# EAGLE design usbboarduino20 (EAGLE 9.6.2)
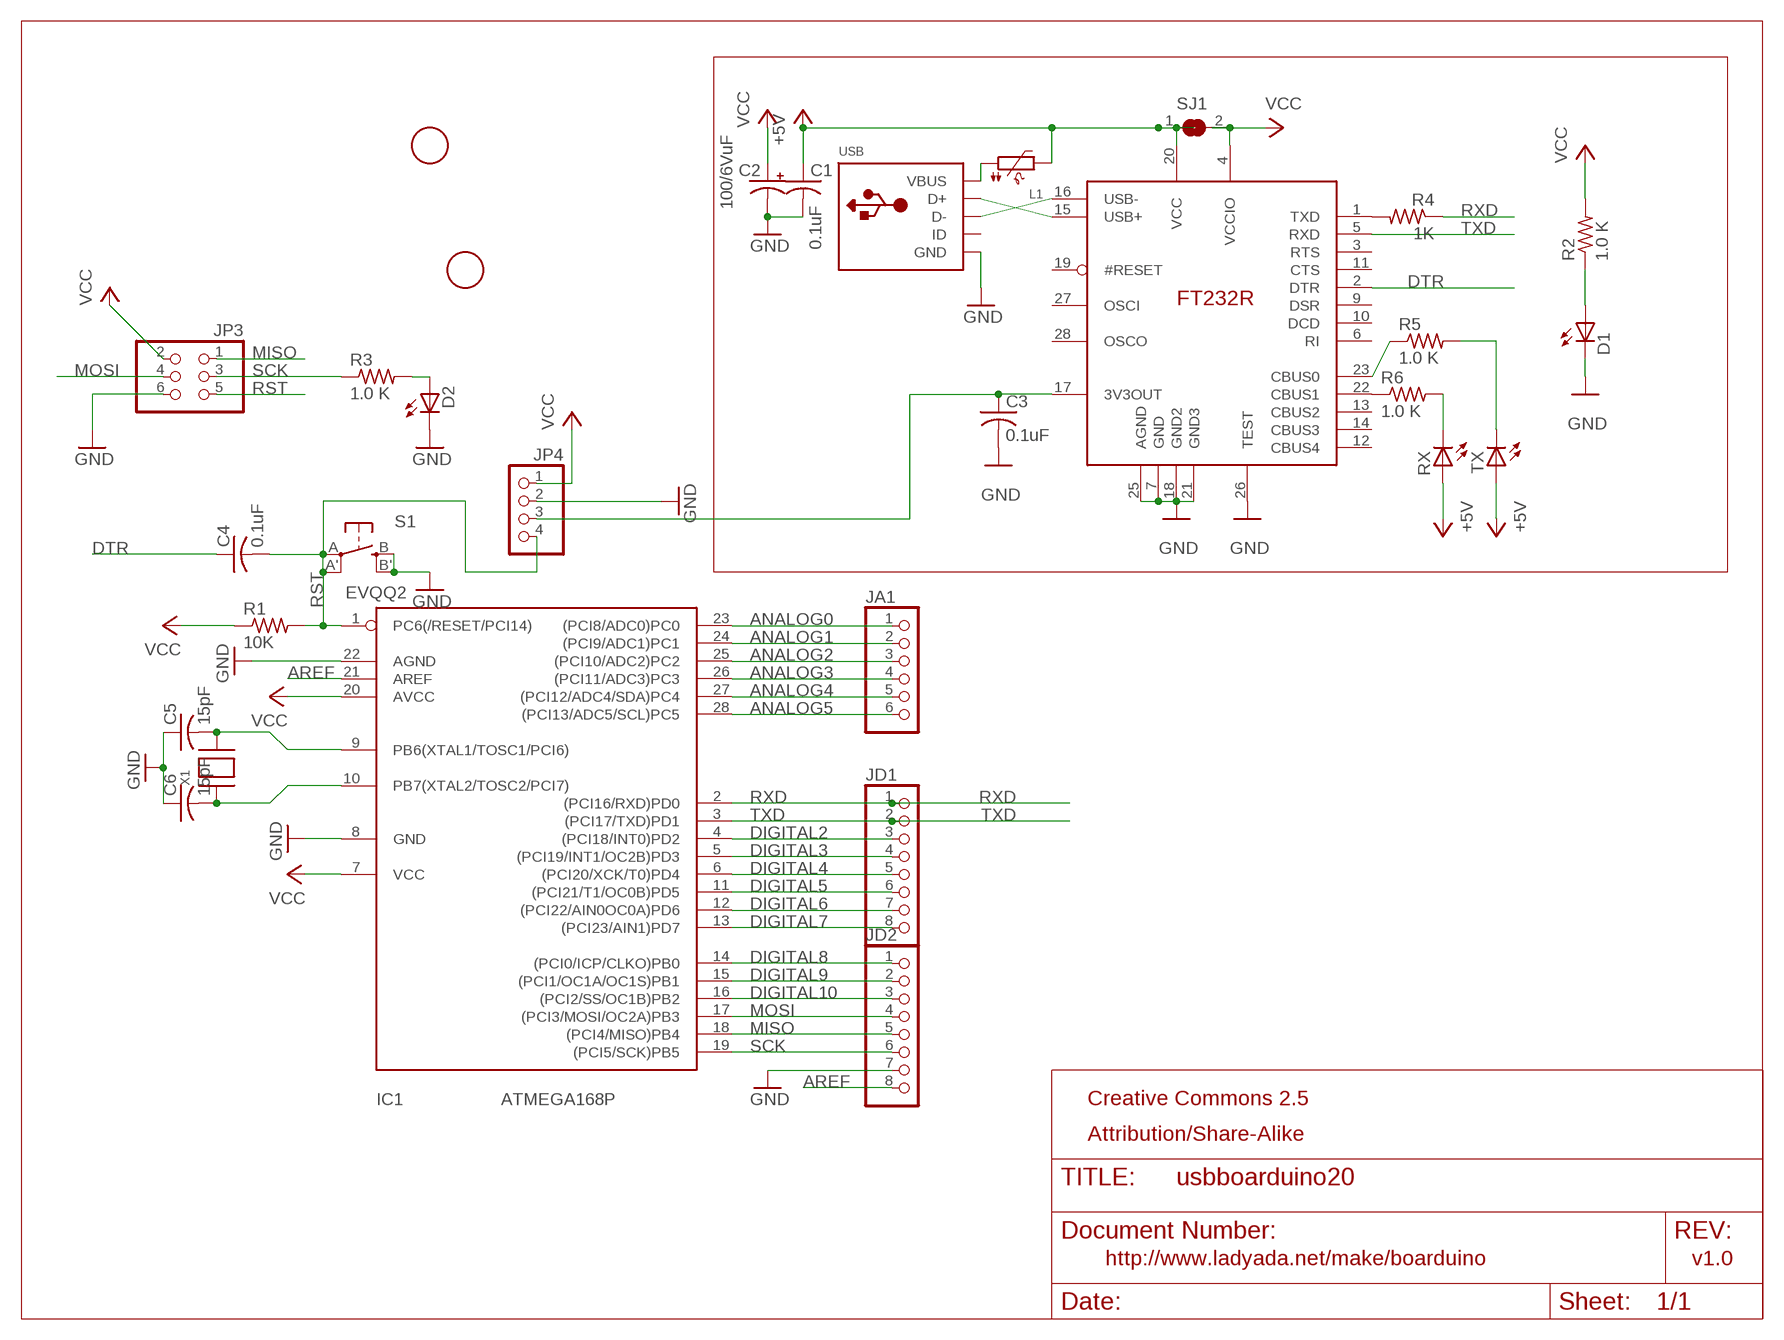
[diagram p0: schematic, sheet 1]

## Parts
C1  0.1uF  C-USC0805K  [C0805K]
C2  100/6VuF  CPOL-USB/3528-21R  [B/3528-21R]
C3  0.1uF  C-USC0805K  [C0805K]
C4  0.1uF  C-USC0805K  [C0805K]
C5  15pF  C-USC0805K  [C0805K]
C6  15pF  C-USC0805K  [C0805K]
D1  LEDCHIPLED_0805  [CHIPLED_0805]
D2  Green  LEDCHIPLED_0805  [CHIPLED_0805]
IC1  ATMEGA168P  ATMEGA168PROUND  [DIL28/3]
IC2  FT232R  [TSSOP28]
JA1  PINHD-1X6CB  [1X06-CLEANBIG]
JD1  PINHD-1X8CLEANBIG  [1X08-CLEANBIG]
JD2  PINHD-1X8CLEANBIG  [1X08-CLEANBIG]
JP3  PINHD-2X3  [2X03]
JP4  PINHD-1X4CB  [1X04-CB]
L1  PTC1206  [1206]
R1  10K  R-US_R0805  [R0805]
R2  1.0 K  R-US_R0805  [R0805]
R3  1.0 K  R-US_R0805  [R0805]
R4  1K  R-US_R0805  [R0805]
R5  1.0 K  R-US_R0805  [R0805]
R6  1.0 K  R-US_R0805  [R0805]
RX  Green  LEDCHIPLED_0805  [CHIPLED_0805]
S1  EVQQ2  [EVQ-Q2]
SJ1  SOLDERJUMPERREFLOW  [SOLDERJUMPER_REFLOW]
TX  Green  LEDCHIPLED_0805  [CHIPLED_0805]
U$1  FIDUCIAL  [FIDUCIAL_1MM]
U$2  FIDUCIAL  [FIDUCIAL_1MM]
USB  USBMINIB  [USB-MINIB]
X1  XTALNX5032  [NX5032]

## Nets
3V: C3.1 IC2.17(3V3OUT) JP4.3
+5V: C1.1 IC2.20(VCC) L1.2 RX.A SJ1.1 TX.A
ANALOG0: IC1.23((PCI8/ADC0)PC0) JA1.1
ANALOG1: IC1.24((PCI9/ADC1)PC1) JA1.2
ANALOG2: IC1.25((PCI10/ADC2)PC2) JA1.3
ANALOG3: IC1.26((PCI11/ADC3)PC3) JA1.4
ANALOG4: IC1.27((PCI12/ADC4/SDA)PC4) JA1.5
ANALOG5: IC1.28((PCI13/ADC5/SCL)PC5) JA1.6
AREF: IC1.21(AREF) JD2.8
DIGITAL2: IC1.4((PCI18/INT0)PD2) JD1.3
DIGITAL3: IC1.5((PCI19/INT1/OC2B)PD3) JD1.4
DIGITAL4: IC1.6((PCI20/XCK/T0)PD4) JD1.5
DIGITAL5: IC1.11((PCI21/T1/OC0B)PD5) JD1.6
DIGITAL6: IC1.12((PCI22/AIN0OC0A)PD6) JD1.7
DIGITAL7: IC1.13((PCI23/AIN1)PD7) JD1.8
DIGITAL8: IC1.14((PCI0/ICP/CLKO)PB0) JD2.1
DIGITAL9: IC1.15((PCI1/OC1A/OC1S)PB1) JD2.2
DIGITAL10: IC1.16((PCI2/SS/OC1B)PB2) JD2.3
DTR: C4.1 IC2.2(DTR)
GND: C1.2 C2.- C3.2 C5.1 C6.1 D1.C D2.C IC1.8(GND) IC1.22(AGND) IC2.7(GND) IC2.18(GND2) IC2.21(GND3) IC2.25(AGND) IC2.26(TEST) JD2.7 JP3.6 JP4.2 S1.B'(S1) S1.B(S) USB.GND
MISO: IC1.18((PCI4/MISO)PB4) JD2.5 JP3.1
MOSI: IC1.17((PCI3/MOSI/OC2A)PB3) JD2.4 JP3.4
N$1: C5.2 IC1.9(PB6(XTAL1/TOSC1/PCI6)) X1.P$2
N$2: C6.2 IC1.10(PB7(XTAL2/TOSC2/PCI7)) X1.P$1
N$3: D1.A R2.1
N$4: D2.A R3.2
N$5: IC2.15(USB+) USB.D+
N$6: IC2.16(USB-) USB.D-
N$7: IC2.1(TXD) R4.2
N$8: L1.1 USB.VBUS
N$9: R6.2 RX.C
N$10: R5.2 TX.C
N$11: IC2.22(CBUS1) R6.1
N$12: IC2.23(CBUS0) R5.1
RST: C4.2 IC1.1(PC6(/RESET/PCI14)) JP3.5 JP4.4 R1.2 S1.A'(P1) S1.A(P)
RXD: IC1.2((PCI16/RXD)PD0) JD1.1 R4.1
SCK: IC1.19((PCI5/SCK)PB5) JD2.6 JP3.3 R3.1
TXD: IC1.3((PCI17/TXD)PD1) IC2.5(RXD) JD1.2
VCC: C2.+ IC1.7(VCC) IC1.20(AVCC) IC2.4(VCCIO) JP3.2 JP4.1 R1.1 R2.2 SJ1.2
Unconnected: IC2.3(RTS) IC2.6(RI) IC2.9(DSR) IC2.10(DCD) IC2.11(CTS) IC2.12(CBUS4) IC2.13(CBUS2) IC2.14(CBUS3) IC2.19(#RESET) IC2.27(OSCI) IC2.28(OSCO) USB.ID

## Notes on the sheet
- Creative Commons 2.5
- Attribution/Share-Alike
- http://www.ladyada.net/make/boarduino | v1.0

## Library data of the parts
C1 C3-C6 = adafruit:C-US: CAPACITOR, American symbol
C2 = adafruit:CPOL-US: POLARIZED CAPACITOR, American symbol
D1 D2 RX TX = adafruit:LED: LED OSRAM: - CHIPLED LG R971, LG N971, LY N971, LG Q971, LY Q971, LO R971, LY R971 LH N974, LH R974 LS Q976, LO Q976, LY Q976 LO Q996 - Hyper CHIPLED LW Q18S LB Q993, LB Q99A, LB R99A - SideLED LS A670, LO A670, LY A670, LG A670, LP A670 LB A673, LV A673, LT A673, LW A673 LH A674 LY A675 LS A676, LA A676, LO A676, LY A676, LW A676 LS A679, LY A679, LG A679 - Hyper Micro SIDELED® LS Y876, LA Y876, LO Y876, LY Y876 LT Y87S - SmartLED LW L88C, LW L88S LB L89C, LB L89S, LG L890 LS L89K, LO L89K, LY L89K LS L896, LA L896, LO L896, LY L896 - TOPLED LS T670, LO T670, LY T670, LG T670, LP T670 LSG T670, LSP T670, LSY T670, LOP T670, LYG T670 LG T671, LOG T671, LSG T671 LB T673, LV T673, LT T673, LW T673 LH T674 LS T676, LA T676, LO T676, LY T676, LB T676, LH T676, LSB T676, LW T676 LB T67C, LV T67C, LT T67C, LS T67K, LO T67K, LY T67K, LW E67C LS E67B, LA E67B, LO E67B, LY E67B, LB E67C, LV E67C, LT E67C LW T67C LS T679, LY T679, LG T679 LS T770, LO T770, LY T770, LG T770, LP T770 LB T773, LV T773, LT T773, LW T773 LH T774 LS E675, LA E675, LY E675, LS T675 LS T776, LA T776, LO T776, LY T776, LB T776 LHGB T686 LT T68C, LB T68C - Hyper Mini TOPLED® LB M676 - Mini TOPLED Santana® LG M470 LS M47K, LO M47K, LY M47K Source: http://www.osram.convergy.de/
IC1 = avr:ATMEGA168*P: MICROCONTROLLER 16 kBytes FLASH 1 kBytes SRAM 512 Bytes EEPROM USART 8-channel 10 bit ADC
IC2 = ft232:FT232R
JA1 = carduino:PINHD-1X6: PIN HEADER
JD1 JD2 = carduino:PINHD-1X8: PIN HEADER
JP3 = pinhead-ez:PINHD-2X3: PIN HEADER
JP4 = carduino:PINHD-1X4: PIN HEADER
L1 = microbuilder:PTC: PTC (Resettable Fuse) 1206 Package 250mA PTC (16V Max, Time-to-Trip: 0.08s) - Digikey: F2110CT-ND 1210 Package 100mA PTC (30V Max, Time-to-Trip: 0.6s) - Digikey: MF-USMF010-2CT-ND 1812 Package 750mA PTC (24V Max, Time-to-Trip: 0.2s) - Digikey: MF-MSMF075/24-2CT-ND
R1-R6 = adafruit:R-US_: RESISTOR, American symbol
S1 = adafruit:EVQQ2: SMT 6mm switch, EVQQ2 series http://www.ladyada.net/library/eagle
SJ1 = microbuilder:SOLDERJUMPER: SMD Solder JUMPER Solder the two pads together to create a connection, or remove the solder to break it. REFLOW - Use this footprint for solder paste and reflow ovens. WAVE - Use this footprint for hand-soldering (larger pads).
U$1 U$2 = adafruit:FIDUCIAL: For use by pick and place machines to calibrate the vision/machine, 1mm By microbuilder.eu
USB = adafruit:USB: USB Connectors USBMINIB - Surface Mount Female Mini-B USB Connector 4UConnector: 06564 By microbuilder.eu Thru-hole RA Female Mini-B USB Connector 4UConnector: 18732 By ladyada.net
X1 = adafruit:XTAL: Low cost SMT crystals, no capacitors included http://www.ladyada.net/library/eagle

## Board
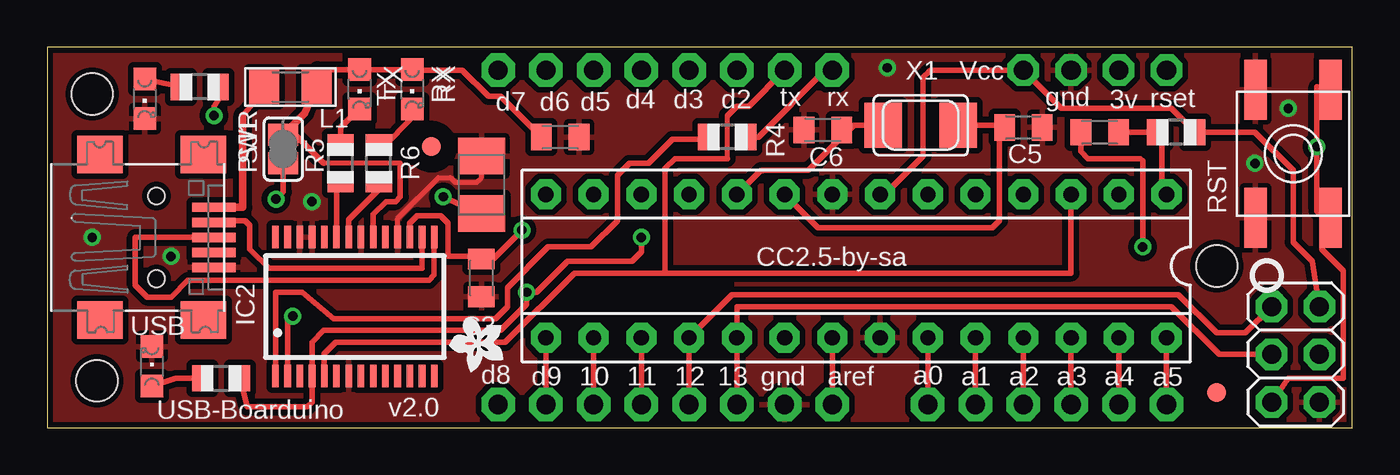
[diagram p1: board, top side]
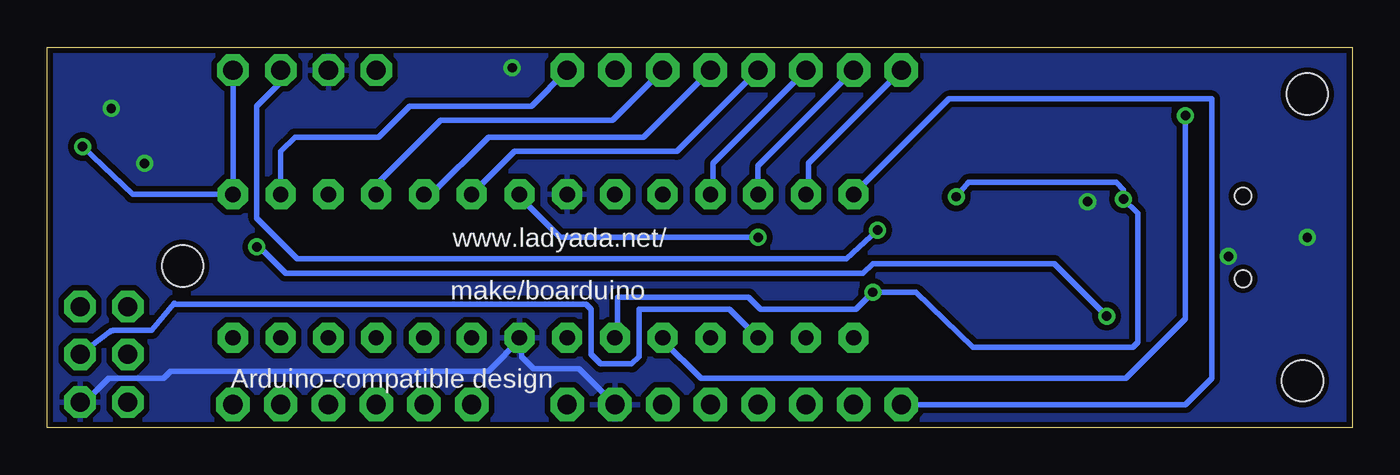
[diagram p2: board, bottom side, seen from below]

Size 69.45 x 20.24 mm. Coordinates in mm from the lower left corner, seen from the top.
Outline: 0,0 69.45,0 69.45,20.24 0,20.24 0,0
Copper layers (1*16): Top 0.035mm / dielectric 1.5mm / Bottom 0.035mm
Design rules "default *": minimum track width 12mil, minimum drill 19mil, track to track 10mil, track to pad 10mil, pad to pad 10mil, via to via 10mil, smd to smd 10mil, copper to edge 10mil, drill to drill 8mil, minimum pad ring 10mil, minimum via ring 8mil, stop-mask expansion 4mil, vias tented up to drill 20mil, thermal gap 10mil
Holes 2.2 mm at 62.23,8.6 2.41,17.74 2.66,2.5

### Footprints (pad centres in the part's own frame; a part is rotated, then mirrored left to right if it is on the bottom)
C0805K = smd 1.1 x 1.4: 1 -1,0; 2 1,0
B/3528-21R = smd 1.95 x 2.5: + 1.525,0; - -1.525,0
CHIPLED_0805 = smd 1.2 x 1.2: A 0,-1.05; C 0,1.05
DIL28/3 = drill 0.813 pad 1.6 octagon: 1 -16.51,-3.81; 2 -13.97,-3.81; 3 -11.43,-3.81; 4 -8.89,-3.81; 5 -6.35,-3.81; 6 -3.81,-3.81; 7 -1.27,-3.81; 8 1.27,-3.81; 9 3.81,-3.81; 10 6.35,-3.81; 11 8.89,-3.81; 12 11.43,-3.81; 13 13.97,-3.81; 14 16.51,-3.81; 15 16.51,3.81; 16 13.97,3.81; 17 11.43,3.81; 18 8.89,3.81; 19 6.35,3.81; 20 3.81,3.81; 21 1.27,3.81; 22 -1.27,3.81; 23 -3.81,3.81; 24 -6.35,3.81; 25 -8.89,3.81; 26 -11.43,3.81; 27 -13.97,3.81; 28 -16.51,3.81
TSSOP28 = smd 0.35 x 1.2: 1 -4.225,-3.7; 2 -3.575,-3.7; 3 -2.925,-3.7; 4 -2.275,-3.7; 5 -1.625,-3.7; 6 -0.975,-3.7; 7 -0.325,-3.7; 8 0.325,-3.7; 9 0.975,-3.7; 10 1.625,-3.7; 11 2.275,-3.7; 12 2.925,-3.7; 13 3.575,-3.7; 14 4.225,-3.7; 15 4.225,3.7; 16 3.575,3.7; 17 2.925,3.7; 18 2.275,3.7; 19 1.625,3.7; 20 0.975,3.7; 21 0.325,3.7; 22 -0.325,3.7; 23 -0.975,3.7; 24 -1.625,3.7; 25 -2.275,3.7; 26 -2.925,3.7; 27 -3.575,3.7; 28 -4.225,3.7
1X06-CLEANBIG = drill 1.016 pad 1.778 octagon: 1 -6.35,0; 2 -3.81,0; 3 -1.27,0; 4 1.27,0; 5 3.81,0; 6 6.35,0
1X08-CLEANBIG = drill 1.016 pad 1.778 octagon: 1 -8.89,0; 2 -6.35,0; 3 -3.81,0; 4 -1.27,0; 5 1.27,0; 6 3.81,0; 7 6.35,0; 8 8.89,0
2X03 = drill 1.016 pad 1.676 octagon: 1 -2.54,-1.27; 2 -2.54,1.27; 3 0,-1.27; 4 0,1.27; 5 2.54,-1.27; 6 2.54,1.27
1X04-CB = drill 1.016 pad 1.676 octagon: 1 -3.81,0; 2 -1.27,0; 3 1.27,0; 4 3.81,0
1206 = smd 1.6 x 1.8: 1 -1.4,0; 2 1.4,0
R0805 = smd 1.1 x 1.4: 1 -1,0; 2 1,0
EVQ-Q2 = smd 3.2 x 1.2: A -3.4,-2; A' 3.4,-2; B -3.4,2; B' 3.4,2
SOLDERJUMPER_REFLOW = smd 1.168 x 1.6: 1 -0.762,0; 2 0.762,0
FIDUCIAL_1MM = smd 1 x 1: 1 0,0
USB-MINIB = smd 0.5 x 2.308: D+ 0,4.064; D- -0.8,4.064; GND 1.6,4.064; ID 0.8,4.064; VBUS -1.6,4.064 | smd 2 x 2.4: GND1 -4.4,-2; GND2 -4.4,3.5; GND3 4.4,3.5; GND4 4.4,-2 | hole 0.9: -2.2,1; 2.2,1
NX5032 = smd 2 x 2.4: P$1 2,0; P$2 -2,0

### Placement (x,y rotation side)
C1  27.3,15.46 0 top
C2  23.11,12.92 270 top
C3  23.11,7.96 270 top
C4  56,15.71 0 top
C5  51.94,15.96 180 top
C6  41.27,15.84 0 top
D1  5.58,3.26 0 top
D2  5.2,17.49 180 top
IC1  43.05,8.6 180 top
IC2  16.38,6.44 0 top
JA1  53.21,1.23 0 top
JD1  32.89,19.01 180 top
JD2  32.89,1.23 0 top
JP3  66.42,3.9 270 top
JP4  55.75,19.01 0 top
L1  12.95,18.12 0 top
R1  60.07,15.71 180 top
R2  9.27,2.63 0 top
R3  8.12,18.12 180 top
R4  36.19,15.46 180 top
R5  15.62,14.06 90 top
R6  17.65,14.06 90 top
RX  19.43,18 180 top
S1  66.29,14.57 90 top
SJ1  12.57,14.82 270 top
TX  16.63,18 180 top
U$1  62.23,1.87 0 top
U$2  20.44,14.95 0 top
U$3  [ADAFRUIT200MIL]  22.85,4.28 90 top
USB  4.82,10.12 270 top
X1  46.48,16.09 180 top

### Tracks (layer width: path | path; a pad name or v marks a point on that pad's centre or on a via)
3V  (via drill 0.5)
  Top 0.305: IC2.17 19.3,10.5 19.3,10.88 19.7,11.28 20.93,11.28 21.33,10.88 21.33,9.11 23.11,9.11 23.74,8.98 | 23.74,8.98 C3.1 | 23.74,8.98 v25.27,10.5
  Bottom 0.305: JP4.3 56.89,18.89 56.89,18.5 58.29,17.11 58.29,11.14 56.13,8.98 26.92,8.98 v25.27,10.5
+5V
  Top 0.254: 18.79,14.06 14.73,14.06
  Top 0.305: SJ1.1 13.2,15.58 14.73,14.06 | 18.79,14.06 18.79,12.28 18.54,12.03 18.03,12.03 17.35,11.35 IC2.20 | 13.71,18.5 13.71,18.13 L1.2 14.22,18.12 14.09,18.25 14.38,19.05 TX.A 16.63,19.14 16.54,19.05 RX.A 19.43,19.01 22.09,19.01 23.49,17.62 24.14,17.62 C1.1
  Top 0.406: L1.2 13.71,16.73 SJ1.1
ANALOG0
  Top 0.305: 46.86,4.66 IC1.23 | JA1.1 46.86,4.66 | 46.86,4.66 46.73,4.66
ANALOG1
  Top 0.305: JA1.2 IC1.24 49.52,4.79
ANALOG2
  Top 0.305: 51.94,4.66 IC1.25 | JA1.3 51.94,4.66 | 51.94,4.66 52.19,4.66
ANALOG3
  Top 0.305: JA1.4 IC1.26
ANALOG4
  Top 0.305: JA1.5 IC1.27
ANALOG5
  Top 0.305: JA1.6 IC1.28 59.69,4.79
AREF
  Top 0.305: JD2.8 IC1.21
DIGITAL2
  Bottom 0.305: JD1.3 39.37,16.35 48.51,16.35 51.94,12.92 IC1.4
DIGITAL3
  Bottom 0.305: JD1.4 37.71,15.46 45.97,15.46 49.02,12.41 IC1.5
DIGITAL4
  Bottom 0.305: JD1.5 35.94,14.69 44.57,14.69 IC1.6
DIGITAL5
  Bottom 0.305: IC1.11 34.03,12.54 34.03,14.06 JD1.6
DIGITAL6
  Bottom 0.305: JD1.7 31.62,13.93 IC1.12
DIGITAL7
  Bottom 0.305: IC1.13 28.95,12.41 28.95,14.06 JD1.8
DIGITAL8
  Bottom 0.305: IC1.14 21.46,17.49 7.49,17.49 7.49,2.63 8.88,1.23 JD2.1
DIGITAL9
  Top 0.305: JD2.2 IC1.15
DIGITAL10
  Top 0.305: JD2.3 IC1.16
DTR  (via drill 0.5)
  Top 0.305: IC2.2 12.8,5.93 v13.08,5.93 | v58.29,9.61 58.29,14.19 58.16,14.31 55.37,14.31 54.99,14.69 54.99,15.71 C4.1
  Bottom 0.305: v13.08,5.93 15.87,8.73 25.52,8.73 26.03,8.22 56.76,8.22 58.16,9.61 v58.29,9.61
GND  (via drill 0.5)
  Top 0.254: IC2.18 18.65,11.13 20.82,13.3 21.46,13.3 21.71,13.04 22.85,13.04 23.11,13.3 C2.-
  Bottom 0.305: JD2.7 41.14,3.14 43.56,3.14 44.19,3.77 44.19,4.79 | 44.19,4.79 IC1.22 | 44.19,4.79 45.97,3.01 62.86,3.01 63.24,2.63 66.16,2.63 67.43,1.36 JP3.6
  other vias: 66.03,16.98 6.6,9.11 14.09,12.03 44.7,19.14 64.26,14.06 2.41,10.12
  pour Top (isolate 0.305): -0.01,20.28 -0.01,0.34 20.44,0.34 22.85,0.22 69.34,0.09 69.34,20.03 62.86,20.03 60.7,20.16
  pour Bottom (isolate 0.305): 69.46,20.16 69.34,0.22 -0.39,0.22 -0.13,20.28
MISO
  Top 0.305: 34.29,1.23 JD2.5 IC1.18 36.44,7.07 60.19,7.07 62.23,5.04 63.75,5.04 JP3.1
MOSI
  Top 0.305: JD2.4 31.62,0.98 | 31.62,0.98 IC1.17 | 31.62,0.98 31.74,0.98
  Bottom 0.305: IC1.17 33.14,6.31 37.97,6.31 37.97,3.77 38.35,3.39 40,3.39 40.51,3.9 40.51,6.31 40.76,6.57 62.63,6.57 arc-45 62.68,6.62 63.88,5.17 65.93,5.17 arc-45 66.11,5.09 JP3.4
N$1
  Top 0.305: X1.P$2 50.92,16.09 51.05,15.96 C5.2 50.67,15.69 50.67,11.01 50.29,10.63 41.02,10.63 IC1.9
N$2
  Top 0.305: X1.P$1 42.92,16.09 42.41,15.58 | IC1.10 37.89,13.6 arc-45 38.07,13.68 40.38,13.68 arc45 40.56,13.75 42.39,15.58 42.41,15.58 | 42.41,15.58 arc-45 42.39,15.72 | C6.2 42.29,15.84 42.29,15.71 42.41,15.58
N$3
  Top 0.305: R2.1 6.85,2.63 D1.A
N$4
  Top 0.305: D2.A R3.2
N$5
  Top 0.305: IC2.15 20.6,8.12 20.31,7.84 7.49,7.84 6.6,6.95 5.33,6.95 4.69,7.58 4.69,10.12 USB.D+
N$6
  Top 0.305: IC2.16 19.95,8.47 11.81,8.47 10.79,9.49 10.79,10.76 10.54,11.01 8.97,11.01 USB.D-
N$7
  Top 0.305: IC2.1 12.15,7.2 13.58,7.2 15.24,5.8 23.87,5.8 24.51,6.44 24.51,7.46 26.66,9.61 28.95,9.61 30.35,11.01 30.35,13.42 30.98,14.06 32,14.06 33.27,15.33 35.3,15.33 35.3,15.35 R4.2 35.17,15.47 35.17,15.71
N$8
  Top 0.305: 10.92,18.12 L1.1 11.68,18.12 10.41,16.6
  Top 0.406: USB.VBUS 10.41,11.72 10.41,16.6
N$9
  Top 0.305: R6.2 18.01,15.06 19.3,16.35 19.3,16.98 19.39,16.98 RX.C
N$10
  Top 0.305: TX.C 16.63,16.98 15.62,15.96 R5.2
N$11
  Top 0.305: IC2.22 16.05,11.07 17.9,12.92 17.65,13.17 17.65,13.28 | 17.54,13.17 R6.1 | 17.54,13.17 17.39,13.17 | 17.65,13.28 17.54,13.17 | 17.65,13.28 17.65,13.3
N$12
  Top 0.305: IC2.23 15.4,12.58 15.74,12.92 15.62,13.04 | 16.12,13.04 16,12.92 15.87,13.04 15.62,13.04 | 15.62,13.04 15.49,13.17 15.51,13.17 R5.1 15.62,13.04
RST  (via drill 0.5)
  Top 0.305: IC1.1 59.3,12.66 59.3,15.84 58.94,15.84 R1.2 C4.2 57.15,15.71 | S1.A' 67.56,18.13 67.56,17.11 | 67.56,17.11 67.56,16.09 | 67.56,11.65 67.56,11.52 67.94,11.14 | 67.56,11.65 v67.56,14.95 67.56,17.11 | JP3.5 66.03,2.63 68.96,2.63 68.96,8.34 67.81,9.49 67.81,11.65 67.56,11.65 | 67.94,11.14 S1.A | 67.94,11.14 67.94,11.01
  Bottom 0.305: JP4.4 IC1.1 64.89,12.41 v67.56,14.95
RXD
  Top 0.305: R4.1 37.84,15.46 41.4,19.01 JD1.1
  Bottom 0.305: JD1.1 43.68,17.11 50.16,17.11 51.81,15.46 56.26,15.46 57.02,14.69 IC1.2 57.02,12.28
SCK  (via drill 0.5)
  Top 0.305: IC1.19 JD2.6 | IC1.19 36.7,4.92 36.57,4.92 | IC1.19 36.7,6.44 59.81,6.44 62.35,3.9 JP3.3 | v8.88,16.6 8.88,17.09 9.14,17.47 9.14,18.38 R3.1
  Bottom 0.305: v8.88,16.6 8.88,5.8 12.06,2.63 34.67,2.63 36.7,4.66 IC1.19
TXD
  Top 0.254: 36.19,14.31 36.19,16.6
  Top 0.305: 32.89,8.22 32.89,13.81 33.4,14.31 36.19,14.31 | 36.19,16.6 36.7,17.11 37.33,17.11 JD1.2 | IC1.3 54.48,8.22 32.89,8.22 | 32.89,8.22 28.06,8.22 24.38,4.53 15.36,4.53 14.75,3.92 IC2.5
VCC  (via drill 0.5)
  Top 0.305: R2.2 10.65,1.1 13.84,1.1 14.09,1.36 14.09,2.73 IC2.4 14.1,4.54 14.73,5.17 24.12,5.17 25.52,6.57 v25.52,7.2 26.03,7.2 27.68,8.85 31.11,8.85 31.62,9.36 v31.62,10.12 | JP3.2 67.3,8.85 66.29,9.87 66.29,13.68 64.26,15.71 61.08,15.71 | JP4.1 53.97,16.98 59.81,16.98 61.08,15.71 | v12.19,12.15 12.57,12.54 SJ1.2 | JP4.1 52.07,19.01 | JP4.1 47.09,19.01 arc45 46.91,18.94 46.6,18.63 46.6,14.44 44.57,12.41 IC1.7 | C2.+ 23.11,11.52 22.98,11.39 v21.08,12.28 | 61.08,15.71 R1.1
  Top 0.406: SJ1.2 12.57,15.46
  Bottom 0.305: v31.62,10.12 42.16,10.12 44.32,12.28 IC1.7 | IC1.20 39.11,4.92 39.11,6.95 32.13,6.95 31.49,6.31 26.41,6.31 v25.52,7.2 23.24,7.2 20.19,4.28 11.68,4.28 11.43,4.53 11.43,11.39 v12.19,12.15 12.19,12.66 12.57,13.04 20.44,13.04 v21.08,12.28

### Text on the board
tPlace: Vcc | RX | d6 | d5 | d4 | d3 | d2 | tx | rx | gnd | 3v | TX | d7 | rset | PWR | RST | CC2.5-by-sa | d8 | d9 | 10 | 11 | 12 | 13 | gnd | aref | a0 | a1 | a2 | a3 | a4 | a5 | USB-Boarduino | v2.0
bPlace: www.ladyada.net/ | make/boarduino | Arduino-compatible design